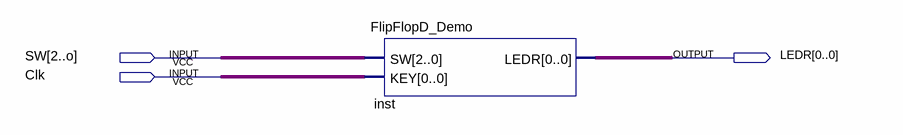
[diagram p0: schematic sheet]
// Quartus schematic FlipFlopD_Demo.bdf as structural Verilog: 1 symbols, 3 pins
module FlipFlopD_Demo (
  input  \SW[2..o] ,
  input  Clk,
  output [0:0] LEDR
);

  wire [2:0] undriven;

  FlipFlopD_Demo inst (.SW(undriven), .KEY(Clk), .LEDR(LEDR[0]));
endmodule
